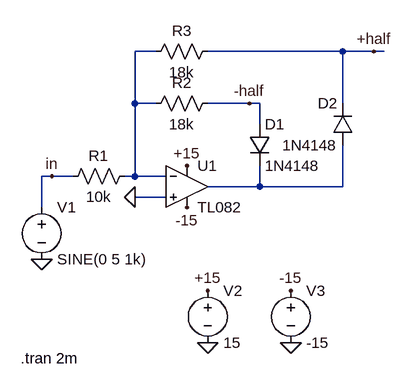
[diagram p0: schematic ideal_diode.asc]
ideal_diode.asc, the LTspice schematic file:
Version 4
SHEET 1 880 680
WIRE 144 -112 112 -112
WIRE 432 -112 224 -112
WIRE 480 -112 432 -112
WIRE 496 -112 480 -112
WIRE 112 -32 112 -112
WIRE 144 -32 112 -32
WIRE 288 -32 224 -32
WIRE 304 -32 288 -32
WIRE 432 -32 432 -112
WIRE 304 0 304 -32
WIRE -16 80 -32 80
WIRE 16 80 -16 80
WIRE 112 80 112 -32
WIRE 112 80 96 80
WIRE 160 80 112 80
WIRE 304 96 304 64
WIRE 304 96 224 96
WIRE 432 96 432 32
WIRE 432 96 304 96
WIRE 160 112 112 112
WIRE -32 128 -32 80
FLAG 224 336 0
FLAG 352 336 0
FLAG 224 256 +15
FLAG 352 256 -15
FLAG -32 208 0
FLAG 112 112 0
FLAG 192 64 +15
FLAG 192 128 -15
FLAG 480 -112 +half
FLAG 288 -32 -half
FLAG -16 80 in
SYMBOL voltage -32 112 R0
WINDOW 123 0 0 Left 0
WINDOW 39 0 0 Left 0
SYMATTR InstName V1
SYMATTR Value SINE(0 5 1k)
SYMBOL voltage 224 240 R0
WINDOW 123 0 0 Left 0
WINDOW 39 0 0 Left 0
SYMATTR InstName V2
SYMATTR Value 15
SYMBOL voltage 352 240 R0
WINDOW 123 0 0 Left 0
WINDOW 39 0 0 Left 0
SYMATTR InstName V3
SYMATTR Value -15
SYMBOL TL082 192 96 R0
SYMATTR InstName U1
SYMBOL res 112 64 R90
WINDOW 0 0 56 VBottom 2
WINDOW 3 32 56 VTop 2
SYMATTR InstName R1
SYMATTR Value 10k
SYMBOL res 240 -48 R90
WINDOW 0 0 56 VBottom 2
WINDOW 3 32 56 VTop 2
SYMATTR InstName R2
SYMATTR Value 18k
SYMBOL diode 288 0 R0
SYMATTR InstName D1
SYMATTR Value 1N4148
SYMBOL res 240 -128 R90
WINDOW 0 0 56 VBottom 2
WINDOW 3 32 56 VTop 2
SYMATTR InstName R3
SYMATTR Value 18k
SYMBOL diode 448 32 R180
WINDOW 0 24 64 Left 2
WINDOW 3 24 0 Left 2
SYMATTR InstName D2
SYMATTR Value 1N4148
TEXT -64 360 Left 2 !.tran 2m

The netlist it stands for:
* ideal_diode.asc
V1 in 0 SINE(0 5 1k)
V2 +15 0 15
V3 -15 0 -15
* U1: TL082 (symbol TL082 not available, pins judged from their places): In+=0 In-=N001 V+=+15 V-=-15 OUT=N002
R1 N001 in 10k
R2 -half N001 18k
D1 -half N002 1N4148
R3 +half N001 18k
D2 N002 +half 1N4148
.model D D
.lib standard.dio
.tran 2m
.backanno
.end